# EAGLE schematic HW2 (EAGLE 8.6.0)
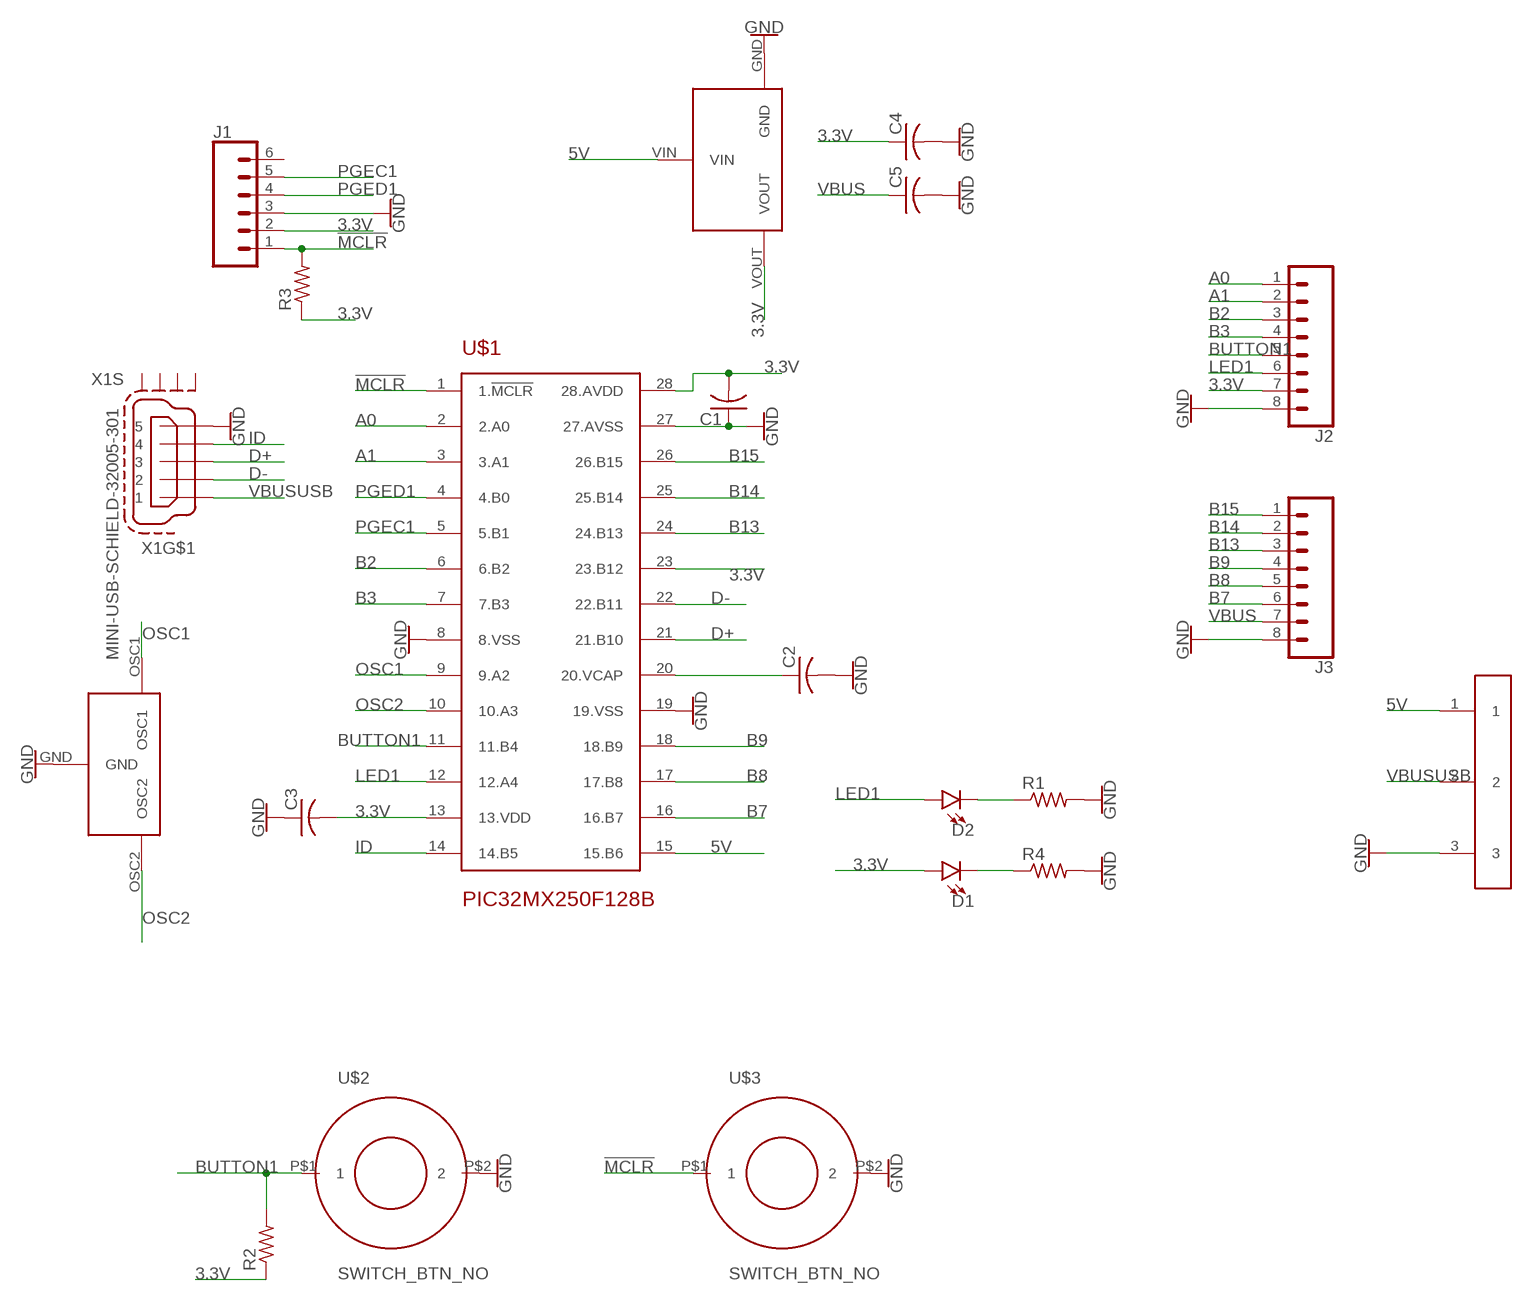
[diagram p0: schematic, sheet 1]

## Parts
C1  C-US025-024X044  [C025-024X044]
C2  C-US025-024X044  [C025-024X044]
C3  C-US025-024X044  [C025-024X044]
C4  C-US025-024X044  [C025-024X044]
C5  C-US025-024X044  [C025-024X044]
D1  LED3MM  [LED_3MM]
D2  LED3MM  [LED_3MM]
J1  CONN_06SILK_FEMALE_PTH  [1X06]
J2  CONN_08"  [1X08]
J3  CONN_08"  [1X08]
R1  R-US_0204/7  [0204/7]
R2  R-US_0204/7  [0204/7]
R3  R-US_0204/7  [0204/7]
R4  R-US_0204/7  [0204/7]
U$1  PIC32MX250F128B  [DIL28-3]
U$2  SWITCH_BTN_NO  [BTN_2]
U$3  SWITCH_BTN_NO  [BTN_2]
U$4  RESONATOR  [1X3]
U$5  VREG3_3V  [1X3_VREG]
U$6  SLIDESWITCH  [SWITCH]
X1  MINI-USB-SCHIELD-32005-301  [32005-301]

## Nets
3.3V: C1.2 C3.2 C4.1 D1.A J1.2 J2.7 R2.1 R3.1 U$1.13(13.VDD) U$1.23(23.B12) U$1.28(28.AVDD) U$5.VOUT
5V: U$1.15(15.B6) U$5.VIN U$6.1
!MCLR: J1.1 R3.2 U$1.1(1.!MCLR) U$3.P$1
A0: J2.1 U$1.2(2.A0)
A1: J2.2 U$1.3(3.A1)
B2: J2.3 U$1.6(6.B2)
B3: J2.4 U$1.7(7.B3)
B7: J3.6 U$1.16(16.B7)
B8: J3.5 U$1.17(17.B8)
B9: J3.4 U$1.18(18.B9)
B13: J3.3 U$1.24(24.B13)
B14: J3.2 U$1.25(25.B14)
B15: J3.1 U$1.26(26.B15)
BUTTON1: J2.5 R2.2 U$1.11(11.B4) U$2.P$1
D+: U$1.21(21.B10) X1.3
D-: U$1.22(22.B11) X1.2
GND: C1.1 C2.2 C3.1 C4.2 C5.2 J1.3 J2.8 J3.8 R1.2 R4.2 U$1.8(8.VSS) U$1.19(19.VSS) U$1.27(27.AVSS) U$2.P$2 U$3.P$2 U$4.GND U$5.GND U$6.3 X1.5
ID: U$1.14(14.B5) X1.4
LED1: D2.A J2.6 U$1.12(12.A4)
N$1: D1.K(C) R4.1
N$4: C2.1 U$1.20(20.VCAP)
N$6: D2.K(C) R1.1
OSC1: U$1.9(9.A2) U$4.OSC1
OSC2: U$1.10(10.A3) U$4.OSC2
PGEC1: J1.5 U$1.5(5.B1)
PGED1: J1.4 U$1.4(4.B0)
VBUS: C5.1 J3.7
VBUSUSB: U$6.2 X1.1
Unconnected: J1.6 X1.M1(S:S1) X1.M2(S:S2) X1.M3(S:S3) X1.M4(S:S4)

## Library data of the parts
C1-C5 = rcl:C-US: CAPACITOR, American symbol; SPICEPREFIX: C
D1 D2 = SparkFun-LED:LED: LED (Generic) Standard schematic elements and footprints for 5mm, 3mm, 1206, and 0603 sized LEDs. Generic LEDs with no color specified.; PROD_ID: DIO-08794
J1 = SparkFun-Connectors:CONN_06: Multi connection point. Often used as Generic Header-pin footprint for 0.1 inch spaced/style header connections On any of the 0.1 inch spaced packages, you can populate with these: Break Away Headers - Straight <https://www.sparkfun.com/products/116> (PRT-00116) Break Away Male Headers - Right Angle <https://www.sparkfun.com/products/553> (PRT-00553) Female Headers <https://www.sparkfun.com/products/115> (PRT-00115) Break Away Headers - Machine Pin <https://www.sparkfun.com/products/117> (PRT-00117) Break Away Female Headers - Swiss Machine Pin <https://www.sparkfun.com/products/743> (PRT-00743) Arduino Stackable Header - 6 Pin <https://www.sparkfun.com/products/9280> (PRT-09280) For SCREWTERMINALS and SPRING TERMINALS visit here: Screw Terimnals on SparkFun.com <https://www.sparkfun.com/search/results?term=Screw+Terminals> (5mm/3.5mm/2.54mm spacing) This device is also useful as a general connection point to wire up your design to another part of your project. Our various solder wires solder well into these plated through hole pads. Hook-Up Wire - Assortment (Stranded, 22 AWG) <https://www.sparkfun.com/products/11375> (PRT-11375) Hook-Up Wire - Assortment (Solid Core, 22 AWG) <https://www.sparkfun.com/products/11367> (PRT-11367) View the entire wire category on our website here <https://www.sparkfun.com/categories/141>; PROD_ID: CONN-08437
J2 J3 = SparkFun-Connectors:CONN_08: Multi connection point. Often used as Generic Header-pin footprint for 0.1 inch spaced/style header connections On any of the 0.1 inch spaced packages, you can populate with these: Break Away Headers - Straight <https://www.sparkfun.com/products/116> (PRT-00116) Break Away Male Headers - Right Angle <https://www.sparkfun.com/products/553> (PRT-00553) Female Headers <https://www.sparkfun.com/products/115> (PRT-00115) Break Away Headers - Machine Pin <https://www.sparkfun.com/products/117> (PRT-00117) Break Away Female Headers - Swiss Machine Pin <https://www.sparkfun.com/products/743> (PRT-00743) Arduino Stackable Header - 8 Pin <https://www.sparkfun.com/products/9279> (PRT-09279) For SCREWTERMINALS and SPRING TERMINALS visit here: Screw Terimnals on SparkFun.com <https://www.sparkfun.com/search/results?term=Screw+Terminals> (5mm/3.5mm/2.54mm spacing) This device is also useful as a general connection point to wire up your design to another part of your project. Our various solder wires solder well into these plated through hole pads. Hook-Up Wire - Assortment (Stranded, 22 AWG) <https://www.sparkfun.com/products/11375> (PRT-11375) Hook-Up Wire - Assortment (Solid Core, 22 AWG) <https://www.sparkfun.com/products/11367> (PRT-11367) View the entire wire category on our website here <https://www.sparkfun.com/categories/141> Special notes: Molex polarized connector foot print use with SKU : PRT-08231 with associated crimp pins and housings. 1MM SMD Version SKU: PRT-10208 NOTES ON THE VARIANTS LOCK and LOCK_LONGPADS... This footprint was designed to help hold the alignment of a through-hole component (i.e. 6-pin header) while soldering it into place. You may notice that each hole has been shifted either up or down by 0.005 of an inch from it's more standard position (which is a perfectly straight line). This slight alteration caused the pins (the squares in the middle) to touch the edges of the holes. Because they are alternating, it causes a "brace" to hold the component in place. 0.005 has proven to be the perfect amount of "off-center" position when using our standard breakaway headers. Although looks a little odd when you look at the bare footprint, once you have a header in there, the alteration is very hard to notice. Also,if you push a header all the way into place, it is covered up entirely on the bottom side.; PROD_ID: CONN-08438
R1-R4 = resistor:R-US_: RESISTOR, American symbol
U$1 = Ilya_Teach:PIC32MX250F128B
U$2 U$3 = Ilya_Teach:SWITCH_BTN_NO
U$4 = Ilya_Teach:RESONATOR
U$5 = Ilya_Teach:VREG3_3V
U$6 = Ilya_Teach:SLIDESWITCH
X1 = con-cypressindustries:MINI-USB-SCHIELD-: MINI USB-B Conector Source: www.cypressindustries.com; OC_FARNELL: unknown; OC_NEWARK: unknown